# Altium schematic sheet Sheet1.SchDoc
size A; SheetNumber: 1; SheetTotal: 1
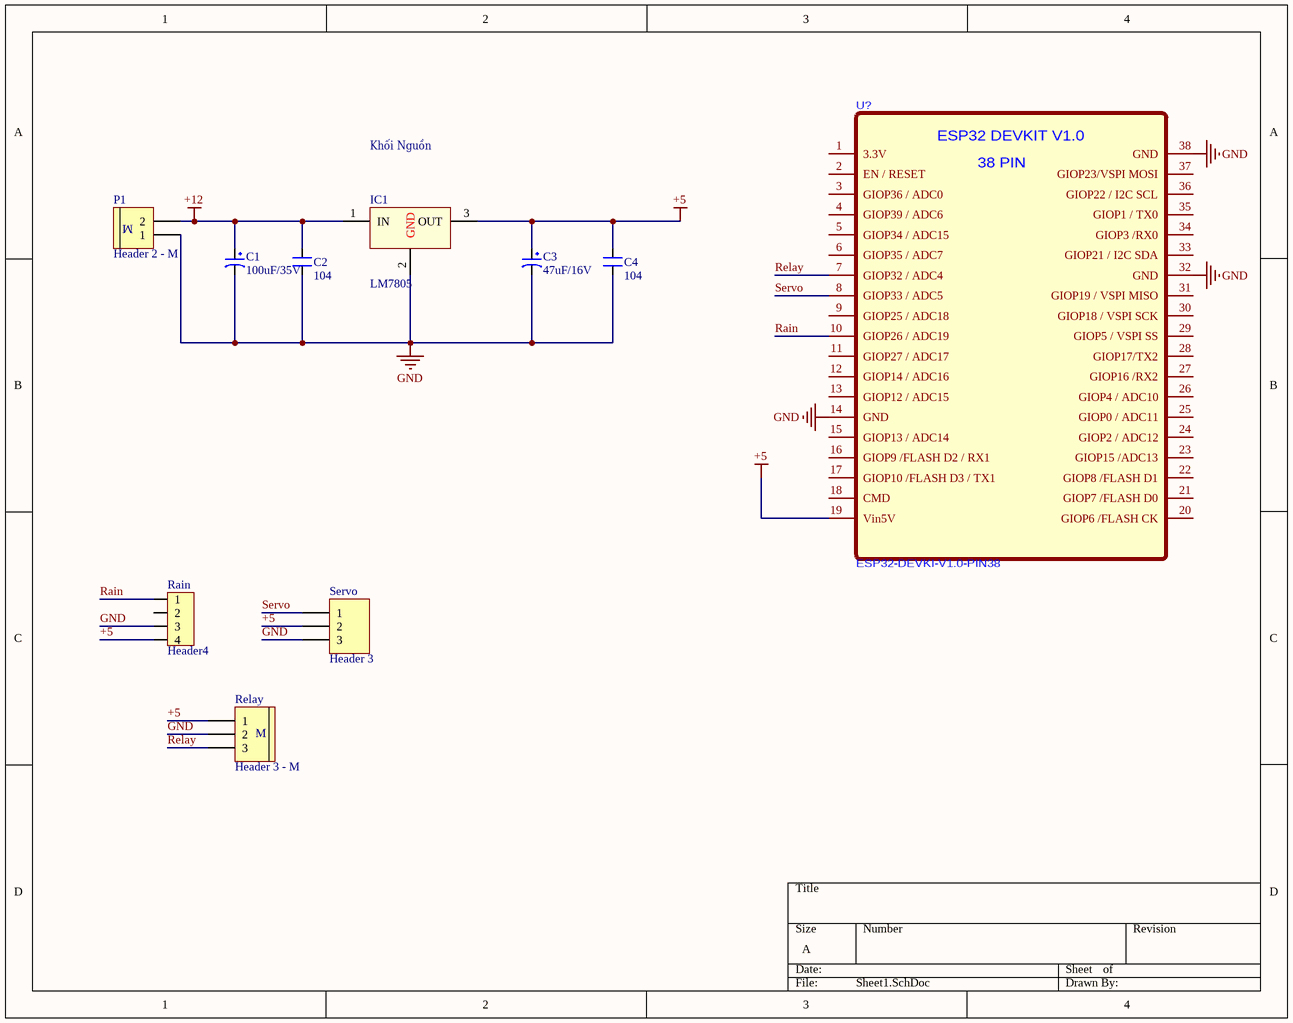
[diagram p0: Sheet1.SchDoc]

## Parts
C1  100uF/35V  [CP1.5/3.4]
C2  104  [CN1]
C3  47uF/16V  [CP1.5/3.4]
C4  104  [CN1]
IC1  LM7805  [QTO-220]
P1  Header 2 - M  [Medium - Header 2]
Rain  Header4  [HDR4]
Relay  Header 3 - M  [Medium - Header 3]
Servo  Header 3  [HDR1X3]
U?  ESP32-DEVKI-V1.0-PIN38  [ESP32-DEVKIT-V1.0-38PIN]

## Nets
+5: C3.1 C4.2 IC1.3(OUT) Rain.4 Relay.1 Servo.2 U?.19(Vin5V)
+12: C1.1 C2.2 IC1.1(IN) P1.2
GND: C1.2 C2.1 C3.2 C4.1 IC1.2(GND) P1.1 Rain.3 Relay.2 Servo.3 U?.14(GND) U?.32(GND) U?.38(GND)
Rain: Rain.1 U?.10(GIOP26_/_ADC19)
Relay: Relay.3 U?.7(GIOP32_/_ADC4)
Servo: Servo.1 U?.8(GIOP33_/_ADC5)

Not connected (* = marked no-connect by the designer): Rain 2; U? 1(3.3V) 2(EN_/_RESET) 3(GIOP36_/_ADC0) 4(GIOP39_/_ADC6) 5(GIOP34_/_ADC15) 6(GIOP35_/_ADC7) 9(GIOP25_/_ADC18) 11(GIOP27_/_ADC17) 12(GIOP14_/_ADC16) 13(GIOP12_/_ADC15) 15(GIOP13_/_ADC14) 16(GIOP9_/FLASH_D2_/_RX1) 17(GIOP10_/FLASH_D3_/_TX1) 18(CMD) 20(GIOP6_/FLASH_CK) 21(GIOP7_/FLASH_D0) 22(GIOP8_/FLASH_D1) 23(GIOP15_/ADC13) 24(GIOP2_/_ADC12) 25(GIOP0_/_ADC11) 26(GIOP4_/_ADC10) 27(GIOP16_/RX2) 28(GIOP17/TX2) 29(GIOP5_/_VSPI_SS) 30(GIOP18_/_VSPI_SCK) 31(GIOP19_/_VSPI_MISO) 33(GIOP21_/_I2C_SDA) 34(GIOP3_/RX0) 35(GIOP1_/_TX0) 36(GIOP22_/_I2C_SCL) 37(GIOP23/VSPI_MOSI)

## Notes on the sheet
- Khối Nguồn
- (in symbol ESP32-DEVKI-V1.0-PIN38) ESP32 DEVKIT V1.0; 38 PIN
- (in symbol Header 2 - M) M
- (in symbol Header 3 - M) M

## Library data of the parts
C1 C3 = CP3: Cap 100uF/35V - 470uF/16V; Value: 100uF/35V/50V; Description 1: 1000uF/6,3V - 470uF/16V - 330uF - 25V; Description 2: 220uF/35V - 100uF/50V - 63V - 4,7uF/200V; Description 3: 22uF => 33uF100V - 3,3uF => 4,7uF/250V; Description 4: 2,2uF =>3,3uF/350 - 2,2uF/400V - 1uF/450V
C2 C4 = CN1: Cap np  1pF - 472pF; Value: 100pF
IC1 = LM78xx: On ap +, from + 5 to + 24VDC; Value: LM7805
P1 = Header 2 - M: Header, 2-Pin, Medium; LatestRevisionDate: 17-Jul-2002; LatestRevisionNote: Re-released for DXP Platform.; Publisher: Altium Limited
Rain = Header4: Header IDC, 4 x 1 Pin Vertical 2.54mm Pitch (Non-Boxed, Male); Manufacturer: W¨¹rth Elektronik eiSos GmbH; partNo: 613002143121; ComponentLink1 Description: Manufacturer; ComponentLink2 Description: Datasheet; NoPins: 02; Created Date: 29 March 2013; ComponentLink1URL: http://www.we-online.com; ComponentLink2URL: http://katalog.we-online.de/em/datasheet/6130xx143121.pdf; Created by: Karrer Zheng
Relay = Header 3 - M: Header, 3-Pin, Medium; LatestRevisionDate: 17-Jul-2002; LatestRevisionNote: Re-released for DXP Platform.; Publisher: Altium Limited
Servo = Header 3: Header, 3-Pin; LatestRevisionDate: 17-Jul-2002; LatestRevisionNote: Re-released for DXP Platform.; Publisher: Altium Limited